# EAGLE design tappytap (EAGLE 7.3.0)
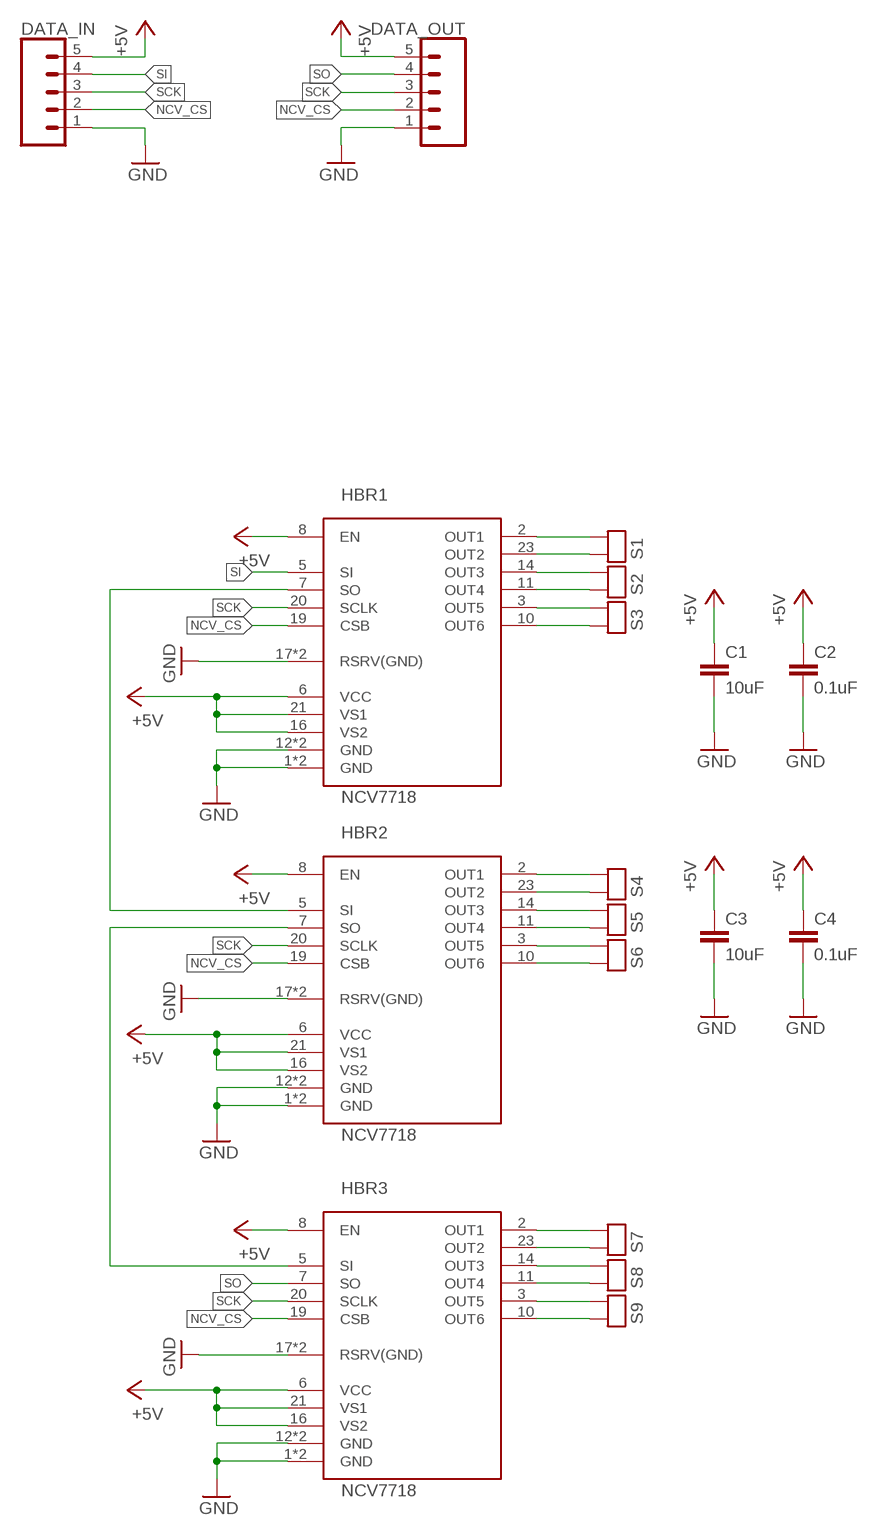
[diagram p0: schematic, sheet 1]

## Parts
C1  10uF  C-EUC0603  [C0603]
C2  0.1uF  C-EUC0603  [C0603]
C3  10uF  C-EUC0603  [C0603]
C4  0.1uF  C-EUC0603  [C0603]
DATA_IN  CONN_05  [1X05]
DATA_OUT  CONN_05  [1X05]
HBR1  NCV7718  [24-SSOP]
HBR2  NCV7718  [24-SSOP]
HBR3  NCV7718  [24-SSOP]
S1  TP2  [TP2_2MM]
S2  TP2  [TP2_2MM]
S3  TP2  [TP2_2MM]
S4  TP2  [TP2_2MM]
S5  TP2  [TP2_2MM]
S6  TP2  [TP2_2MM]
S7  TP2  [TP2_2MM]
S8  TP2  [TP2_2MM]
S9  TP2  [TP2_2MM]

## Nets
+5V [usbvcc]: C1.1 C2.1 C3.1 C4.1 DATA_IN.5 DATA_OUT.5 HBR1.6(VCC) HBR1.8(EN) HBR1.16(VS2) HBR1.21(VS1) HBR2.6(VCC) HBR2.8(EN) HBR2.16(VS2) HBR2.21(VS1) HBR3.6(VCC) HBR3.8(EN) HBR3.16(VS2) HBR3.21(VS1)
GND [gnd]: C1.2 C2.2 C3.2 C4.2 DATA_IN.1 DATA_OUT.1 HBR1.1(GND) HBR1.12(GND) HBR1.13(GND) HBR1.17(RSRV(GND)) HBR1.18(RSRV(GND)) HBR1.24(GND) HBR2.1(GND) HBR2.12(GND) HBR2.13(GND) HBR2.17(RSRV(GND)) HBR2.18(RSRV(GND)) HBR2.24(GND) HBR3.1(GND) HBR3.12(GND) HBR3.13(GND) HBR3.17(RSRV(GND)) HBR3.18(RSRV(GND)) HBR3.24(GND)
N$24: HBR1.7(SO) HBR2.5(SI)
N$26: HBR2.7(SO) HBR3.5(SI)
NCV_CS: DATA_IN.2 DATA_OUT.2 HBR1.19(CSB) HBR2.19(CSB) HBR3.19(CSB)
S1A: HBR1.2(OUT1) S1.P$1
S1B: HBR1.23(OUT2) S1.P$2
S2A: HBR1.14(OUT3) S2.P$1
S2B: HBR1.11(OUT4) S2.P$2
S3A: HBR1.3(OUT5) S3.P$1
S3B: HBR1.10(OUT6) S3.P$2
S4A: HBR2.2(OUT1) S4.P$1
S4B: HBR2.23(OUT2) S4.P$2
S5A: HBR2.14(OUT3) S5.P$1
S5B: HBR2.11(OUT4) S5.P$2
S6A: HBR2.3(OUT5) S6.P$1
S6B: HBR2.10(OUT6) S6.P$2
S7A: HBR3.2(OUT1) S7.P$1
S7B: HBR3.23(OUT2) S7.P$2
S8A: HBR3.14(OUT3) S8.P$1
S8B: HBR3.11(OUT4) S8.P$2
S9A: HBR3.3(OUT5) S9.P$1
S9B: HBR3.10(OUT6) S9.P$2
SCK: DATA_IN.3 DATA_OUT.3 HBR1.20(SCLK) HBR2.20(SCLK) HBR3.20(SCLK)
SI: DATA_IN.4 HBR1.5(SI)
SO: DATA_OUT.4 HBR3.7(SO)

## Library data of the parts
C1-C4 = rcl:C-EU: CAPACITOR, European symbol
DATA_IN DATA_OUT = SparkFun-Connectors:CONN_05: Multi connection point. Often used as Generic Header-pin footprint for 0.1 inch spaced/style header connections On any of the 0.1 inch spaced packages, you can populate with these: Break Away Headers - Straight <https://www.sparkfun.com/products/116> (PRT-00116) Break Away Male Headers - Right Angle <https://www.sparkfun.com/products/553> (PRT-00553) Female Headers <https://www.sparkfun.com/products/115> (PRT-00115) Break Away Headers - Machine Pin <https://www.sparkfun.com/products/117> (PRT-00117) Break Away Female Headers - Swiss Machine Pin <https://www.sparkfun.com/products/743> (PRT-00743) For SCREWTERMINALS and SPRING TERMINALS visit here: Screw Terimnals on SparkFun.com <https://www.sparkfun.com/search/results?term=Screw+Terminals> (5mm/3.5mm/2.54mm spacing) This device is also useful as a general connection point to wire up your design to another part of your project. Our various solder wires solder well into these plated through hole pads. Hook-Up Wire - Assortment (Stranded, 22 AWG) <https://www.sparkfun.com/products/11375> (PRT-11375) Hook-Up Wire - Assortment (Solid Core, 22 AWG) <https://www.sparkfun.com/products/11367> (PRT-11367) View the entire wire category on our website here <https://www.sparkfun.com/categories/141> Special notes: Molex polarized connector foot print use with SKU : PRT-08231 with associated crimp pins and housings. 1MM SMD Version SKU: PRT-10208
HBR1-HBR3 = Sparky:NCV7718: Hex Half−Bridge Driver. The device can be operated in forward, reverse, brake, and high impedance states. The drivers are controlled via a 16 bit SPI interface and are daisy chain compatible.
S1-S9 = Sparky:TP2

## Board
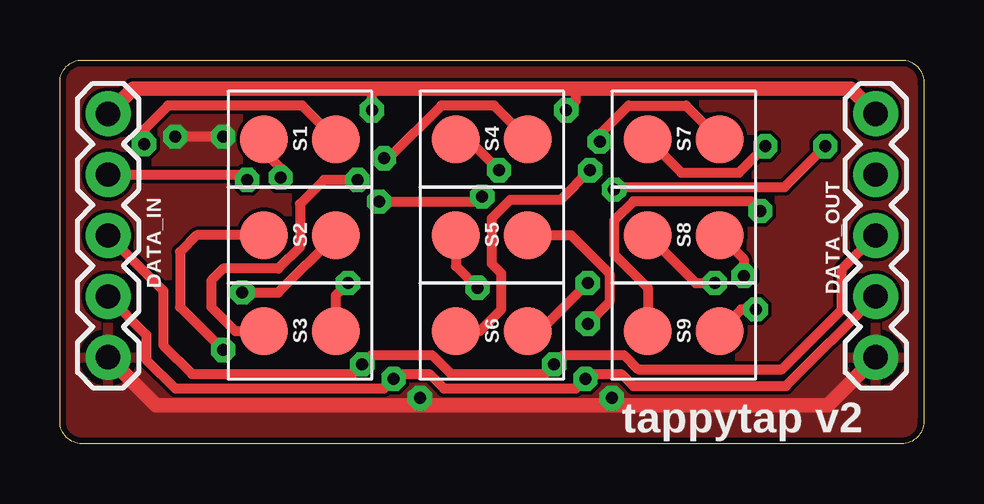
[diagram p1: board, top side]
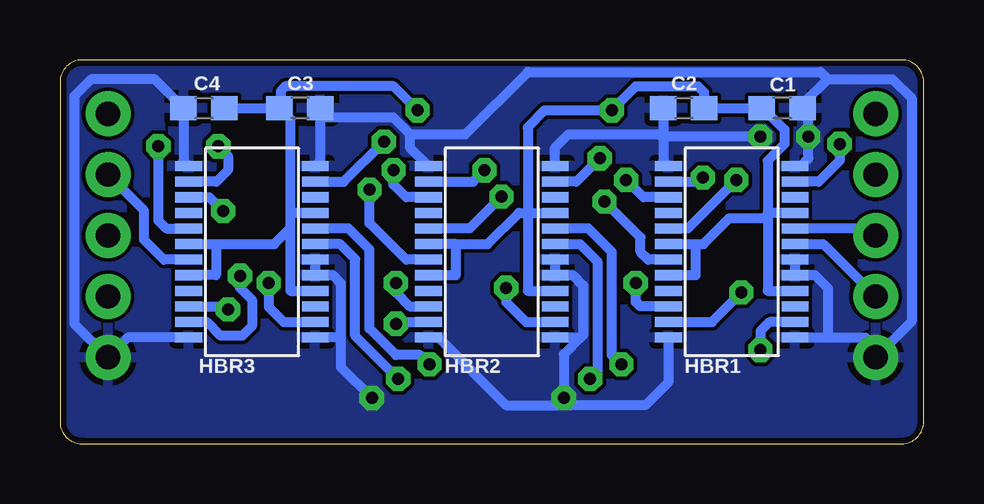
[diagram p2: board, bottom side, seen from below]

Size 36.01 x 16.01 mm. Coordinates in mm from the lower left corner, seen from the top.
Outline: 0,15 arc-100 1,16 35,16 arc-100 36,15 36,1 arc-100 35,0 1,0 arc-100 0,1 0,15
Copper layers (1*16): Top 0.035mm / dielectric 1.6mm / Bottom 0.035mm
Design rules "PCBWay": minimum track width 6mil, minimum drill 0.3mm, track to track 6mil, track to pad 6mil, pad to pad 6mil, via to via 6mil, smd to smd 6mil, copper to edge 10mil, drill to drill 8mil, minimum pad ring 12mil, minimum via ring 10mil, stop-mask expansion 4mil, vias tented up to drill 25mil, thermal gap 10mil

### Footprints (pad centres in the part's own frame; a part is rotated, then mirrored left to right if it is on the bottom)
C0603 = smd 1.1 x 1: 1 -0.85,0; 2 0.85,0
1X05 = drill 1.016 pad 1.88: 1 0,0; 2 2.54,0; 3 5.08,0; 4 7.62,0; 5 10.16,0
24-SSOP = smd 1.12 x 0.42: 1 -2.64,3.575; 2 -2.64,2.925; 3 -2.64,2.275; 4 -2.64,1.625; 5 -2.64,0.975; 6 -2.64,0.325; 7 -2.64,-0.325; 8 -2.64,-0.975; 9 -2.64,-1.625; 10 -2.64,-2.275; 11 -2.64,-2.925; 12 -2.64,-3.575; 13 2.64,-3.575; 14 2.64,-2.925; 15 2.64,-2.275; 16 2.64,-1.625; 17 2.64,-0.975; 18 2.64,-0.325; 19 2.64,0.325; 20 2.64,0.975; 21 2.64,1.625; 22 2.64,2.275; 23 2.64,2.925; 24 2.64,3.575
TP2_2MM = smd 2 x 2: P$1 -1.5,0; P$2 1.5,0

### Placement (x,y rotation side)
C1  5.9,14 0 bottom
C2  10,14 180 bottom
C3  26,14 0 bottom
C4  30,14 180 bottom
DATA_IN  2,3.6 90 top
DATA_OUT  34,3.6 90 top
HBR1  8,8 0 bottom
HBR2  18,8 0 bottom
HBR3  28,8 0 bottom
S1  10,12.7 0 top
S2  10,8.7 0 top
S3  10,4.7 0 top
S4  18,12.7 0 top
S5  18,8.7 0 top
S6  18,4.7 0 top
S7  26,12.7 0 top
S8  26,8.7 0 top
S9  26,4.7 0 top

### Tracks (layer width: path | path; a pad name or v marks a point on that pad's centre or on a via)
+5V  (via drill 0.5)
  Top 0.406: v13,13.9 13,14.8 | 21.49,14.8 21.49,14.29 v21.1,13.9
  Top 0.61: DATA_IN.5 3.04,14.8 13,14.8 21.49,14.8 32.96,14.8 DATA_OUT.5
  Bottom 0.406: C4.1 C3.1 | 26.6,13.75 C3.1 | 6.5,9.63 6.5,9.4 | 6.5,9.4 6.5,6.38 HBR1.16 | HBR1.21 6.5,9.63 | HBR1.6 9.5,8.33 | 9.5,8.33 9.18,8.33 8.1,9.4 6.5,9.4 | HBR1.8 9.5,7.03 9.5,8.33 | 16.5,9.63 16.5,13.2 15.8,13.9 v13,13.9 12,14.9 9.4,14.9 9.15,14.65 C2.1 C1.1 6.7,13.95 6.65,13.95 5.8,13.1 5.8,12.5 6.5,11.8 6.5,9.63 | 16.5,9.63 HBR2.21 | 16.5,9.63 16.5,6.38 HBR2.16 | HBR2.8 19.5,7.03 19.5,8.33 | 19.5,8.33 HBR2.6 | C3.1 26.4,13.55 26.4,9.63 | HBR3.16 26.4,6.38 26.4,9 | HBR3.6 29.5,8.33 | 29.5,8.33 29.5,7.03 HBR3.8 | 29.5,8.33 27.08,8.33 26.4,9 | 26.4,9.63 26.4,9 | HBR3.21 26.4,9.63 | 19.5,8.33 18.18,8.33 16.88,9.63 16.5,9.63 | v21.1,13.9 22.1,14.9 26.6,14.9 26.8,14.7 26.8,14.05 C3.1
GND  (via drill 0.5)
  Top 0.406: 14.7,1.6 v15,1.9 | 22.7,1.6 v23,1.9 | v6.8,12.8 v4.8,12.8
  Top 0.61: DATA_OUT.1 32,1.6 22.7,1.6 14.7,1.6 4,1.6 DATA_IN.1
  Bottom 0.406: HBR1.13 4,4.43 | 4,4.43 2.43,4.43 2,4 DATA_IN.1 0.5,5.1 0.5,14.4 1.3,15.2 3.95,15.2 | C2.2 10.85,13 | 10.85,13 10.85,11.79 HBR1.1 | C3.2 25.15,13.5 | 25.15,13.5 25.15,11.79 HBR3.24 | HBR3.1 30.85,11.79 C4.2 32.05,15.2 34.7,15.2 35.4,14.5 35.4,5 DATA_OUT.1 33.18,4.43 HBR3.12 | 24.3,4.43 HBR3.13 | HBR2.17 15.36,7 | HBR1.18 HBR1.17 4.53,7.03 4,6.5 4,4.43 | HBR2.18 HBR2.17 | HBR3.18 HBR3.17 24.63,7.03 24.3,6.7 24.3,4.43 | HBR2.17 14.63,7.03 14.2,6.6 14.2,4.53 14.3,4.43 | HBR2.24 15.36,12.34 14.8,12.9 11,12.9 | 11,12.9 10.95,12.9 10.85,13 | HBR2.13 14.3,4.43 | HBR1.12 10.64,2.56 11.6,1.6 14.7,1.6 | 14.7,1.6 v15,1.9 15,3.73 14.3,4.43 | HBR2.12 20.23,4.43 17.4,1.6 14.7,1.6 | 24.3,4.43 24.3,3.2 v23,1.9 | HBR2.1 21.4,12.34 21.4,12.9 | 21.4,12.9 22.1,13.6 25.05,13.6 25.15,13.5 | 21.4,12.9 19.1,12.9 16.5,15.5 4.3,15.5 4,15.2 5.05,14.15 C1.2 | HBR1.24 5.13,11.58 4.8,11.9 v4.8,12.8 4.8,13.5 5.2,13.9 | v6.8,12.8 10.9,12.8 11,12.9
  pour Bottom: 0,15 arc-100 1,16 35,16 arc-100 36,15 36,1 arc-100 35,0 1,0 arc-100 0,1
  pour Top: 0,15 arc-100 1,16 35,16 arc-100 36,15 36,1 arc-100 35,0 1,0 arc-100 0,1
N$24  (via drill 0.5)
  Top 0.406: v13.3,10.1 17.4,10.1 v17.6,10.3
  Bottom 0.406: HBR1.7 11.48,7.68 11.8,8 11.8,8.6 v13.3,10.1 | v17.6,10.3 18.93,8.98 HBR2.5
N$26  (via drill 0.5)
  Top 0.406: v23.1,10.6 23.2,10.7 30.2,10.7 v31.9,12.4
  Bottom 0.406: HBR2.7 21.58,7.68 23.1,9.2 v23.1,10.6 | v31.9,12.4 31.9,9.3 31.58,8.98 HBR3.5
NCV_CS  (via drill 0.5)
  Top 0.406: DATA_IN.2 3.6,4.54 3.6,3.5 4.8,2.3 13.5,2.3 v13.9,2.7 14.1,2.9 15.4,2.9 16,2.3 21.5,2.3 v21.9,2.7 22.1,2.9 23.4,2.9 23.9,2.4 30.26,2.4 DATA_OUT.2
  Bottom 0.406: HBR1.19 4.19,8.33 DATA_IN.2 | HBR2.19 14.33,8.33 13.6,7.6 13.6,3 v13.9,2.7 | v21.9,2.7 23.7,4.5 23.7,7.7 24.33,8.33 HBR3.19
S1A  (via drill 0.5)
  Top 0.406: S1.P$1 8,12.7 9.2,11.5 v9.2,11.1
  Bottom 0.406: HBR1.2 9.38,10.93 v9.2,11.1
S1B  (via drill 0.5)
  Top 0.406: S1.P$2 10.1,14.1 4.5,14.1 3.5,13.1 v3.5,12.5
  Bottom 0.406: v3.5,12.5 3.5,11.8 4.38,10.93 HBR1.23
S2A  (via drill 0.5)
  Top 0.406: S2.P$1 5.7,8.7 5,8 5,5.7 v6.8,3.9
  Bottom 0.406: HBR1.14 6.43,5.08 6.8,4.7 v6.8,3.9
S2B  (via drill 0.5)
  Top 0.406: v7.6,6.3 9.1,6.3 S2.P$2
  Bottom 0.406: HBR1.11 8.83,5.08 v7.6,6.3
S3A  (via drill 0.5)
  Top 0.406: v12.4,11 11,11 10,10 10,8.2 9.1,7.3 6.8,7.3 6.3,6.8 6.3,5.7 7.3,4.7 S3.P$1
  Bottom 0.406: HBR1.3 11.68,10.28 v12.4,11
S3B  (via drill 0.5)
  Top 0.406: S3.P$2 11.5,6.2 v12,6.7
  Bottom 0.406: HBR1.10 11.83,5.73 12,5.9 v12,6.7
S4A  (via drill 0.5)
  Top 0.406: S4.P$1 17,12.7 v18.3,11.4
  Bottom 0.406: HBR2.2 18.78,10.93 v18.3,11.4
S4B  (via drill 0.5)
  Top 0.406: S4.P$2 18.1,14.1 15.9,14.1 13.7,11.9 v13.5,11.9
  Bottom 0.406: v13.5,11.9 14.48,10.93 HBR2.23
S5A  (via drill 0.5)
  Top 0.406: S5.P$1 16.5,7.4 v17.4,6.5
  Bottom 0.406: v17.4,6.5 17.4,5.9 16.58,5.08 HBR2.14
S5B  (via drill 0.5)
  Top 0.406: S5.P$2 21.3,8.7 22.9,7.1 22.9,5.9 v22,5
  Bottom 0.406: v22,5 21.93,5.08 HBR2.11
S6A  (via drill 0.5)
  Top 0.406: S6.P$1 17.5,4.7 18.4,5.6 18.4,7.1 18,7.5 18,9.4 18.78,10.18 20.88,10.18 v22.1,11.4
  Bottom 0.406: HBR2.3 21.58,10.28 22.1,10.8 v22.1,11.4
S6B  (via drill 0.5)
  Top 0.406: S6.P$2 20,4.7 v22,6.7
  Bottom 0.406: v22,6.7 22,6.3 21.43,5.73 HBR2.10
S7A  (via drill 0.5)
  Top 0.406: S7.P$1 25.9,11.3 28.3,11.3 v29.4,12.4
  Bottom 0.406: v29.4,12.4 29,12 29,11.4 29.48,10.93 HBR3.2
S7B  (via drill 0.5)
  Top 0.406: v22.5,12.6 22.5,12.9 23.7,14.1 26.1,14.1 S7.P$2
  Bottom 0.406: HBR3.23 24.18,10.93 v22.5,12.6
S8A  (via drill 0.5)
  Top 0.406: S8.P$1 26.5,6.7 v27.3,6.7
  Bottom 0.406: v27.3,6.7 27.3,5.7 26.68,5.08 HBR3.14
S8B  (via drill 0.5)
  Top 0.406: S8.P$2 28.5,7.7 v28.5,7
  Bottom 0.406: v28.5,7 28.5,6.5 28,6 28,4.9 28.4,4.5 29.3,4.5 29.88,5.08 HBR3.11
S9A  (via drill 0.5)
  Top 0.406: v29.2,9.7 28.8,10.1 23.9,10.1 23.1,9.3 23.1,7.9 24.5,6.5 S9.P$1
  Bottom 0.406: HBR3.3 29.78,10.28 v29.2,9.7
S9B  (via drill 0.5)
  Top 0.406: S9.P$2 28.4,5.6 v29,5.6
  Bottom 0.406: HBR3.10 29.13,5.73 v29,5.6
SCK  (via drill 0.5)
  Top 0.406: DATA_IN.3 4.3,6.38 4.3,4.1 5.5,2.9 12.2,2.9 v12.6,3.3 13,3.7 15.5,3.7 16.3,2.9 20.2,2.9 v20.6,3.3 21,3.7 23.5,3.7 24.1,3.1 30.1,3.1 32.6,5.6 32.6,7.28 DATA_OUT.3
  Bottom 0.406: DATA_IN.3 2.3,8.98 HBR1.20 | v12.6,3.3 13,3.7 13,8 13.98,8.98 HBR2.20 | v20.6,3.3 21,3.7 22,3.7 23.1,4.8 23.1,8.1 23.98,8.98 HBR3.20
SI  (via drill 0.5)
  Top 0.406: DATA_IN.4 7.58,11.22 v7.8,11
  Bottom 0.406: v7.8,11 9.83,8.98 HBR1.5
SO
  Bottom 0.406: HBR3.7 31.68,7.68 32.5,8.5 32.5,9.72 DATA_OUT.4

### Text on the board
tNames: tappytap v2